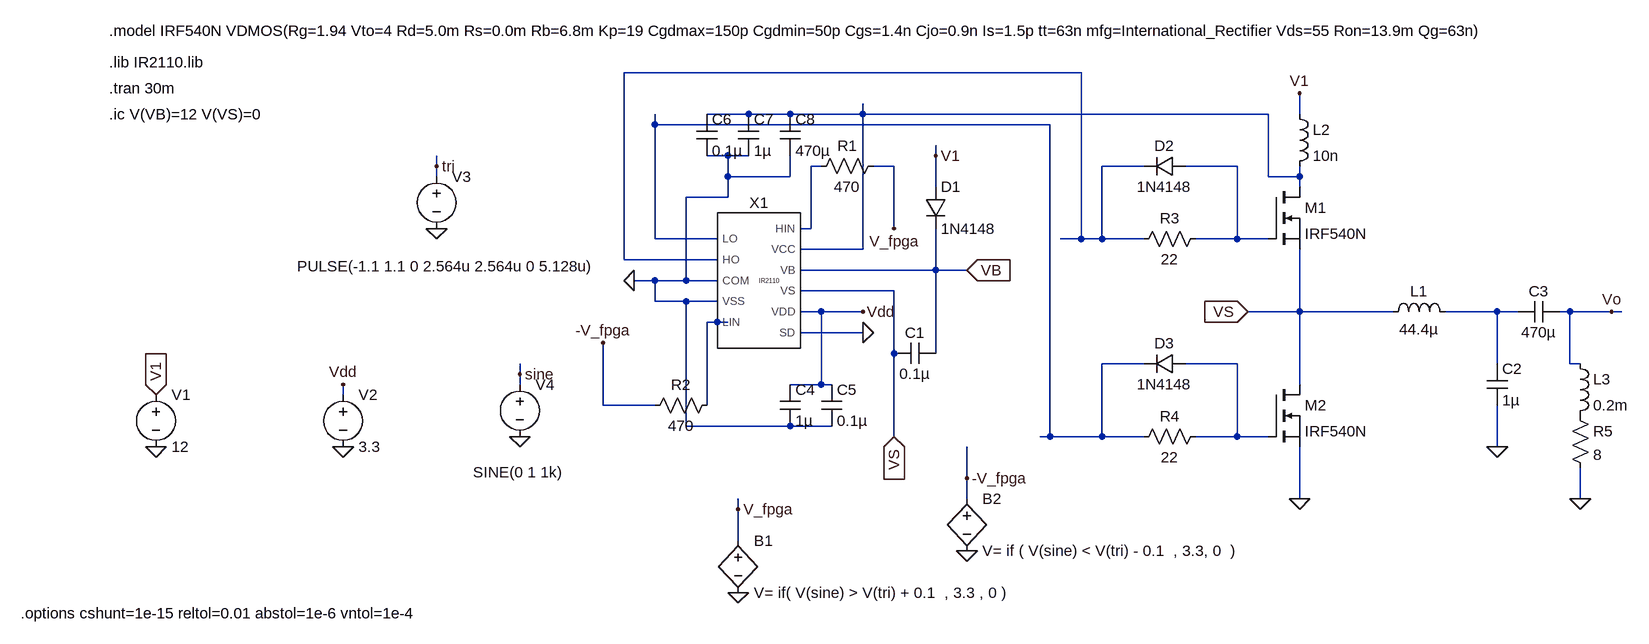
[diagram p0: schematic class_d.asc]
class_d.asc, the LTspice schematic file:
Version 4.1
SHEET 1 1596 704
WIRE 736 -144 32 -144
WIRE 224 -80 160 -80
WIRE 288 -80 224 -80
WIRE 400 -80 400 -96
WIRE 400 -80 288 -80
WIRE 1024 -80 400 -80
WIRE 1072 -80 1072 -112
WIRE 80 -64 80 -80
WIRE 688 -64 80 -64
WIRE 192 -16 160 -16
WIRE 224 -16 192 -16
WIRE 512 -16 512 -32
WIRE -256 0 -256 -16
WIRE 336 0 320 0
WIRE 448 0 416 0
WIRE 832 0 768 0
WIRE 976 0 896 0
WIRE -256 16 -256 0
WIRE 192 16 192 -16
WIRE 288 16 288 -16
WIRE 288 16 192 16
WIRE 1024 16 1024 -80
WIRE 1072 16 1072 0
WIRE 1072 16 1024 16
WIRE 512 32 512 -16
WIRE 1072 32 1072 16
WIRE 192 48 192 16
WIRE 192 48 128 48
WIRE 320 96 320 0
WIRE 320 96 304 96
WIRE 448 96 448 0
WIRE 80 112 80 -64
WIRE 176 112 80 112
WIRE 736 112 736 -144
WIRE 736 112 704 112
WIRE 768 112 768 0
WIRE 768 112 736 112
WIRE 832 112 768 112
WIRE 976 112 976 0
WIRE 976 112 912 112
WIRE 1024 112 976 112
WIRE 400 128 400 -80
WIRE 400 128 304 128
WIRE 32 144 32 -144
WIRE 176 144 32 144
WIRE 512 160 512 96
WIRE 512 160 304 160
WIRE 560 160 512 160
WIRE 80 176 48 176
WIRE 128 176 128 48
WIRE 128 176 80 176
WIRE 176 176 128 176
WIRE 448 192 304 192
WIRE 80 208 80 176
WIRE 128 208 80 208
WIRE 176 208 128 208
WIRE 336 224 304 224
WIRE 400 224 336 224
WIRE 1072 224 1072 128
WIRE 1072 224 992 224
WIRE 1216 224 1072 224
WIRE 1376 224 1296 224
WIRE 1408 224 1376 224
WIRE 1488 224 1472 224
WIRE 1552 224 1488 224
WIRE 1568 224 1552 224
WIRE 176 240 160 240
WIRE 192 240 176 240
WIRE 400 256 304 256
WIRE 448 288 448 192
WIRE 512 288 512 160
WIRE 832 304 768 304
WIRE 976 304 896 304
WIRE 1376 304 1376 224
WIRE 1488 304 1488 224
WIRE 1504 304 1488 304
WIRE -128 320 -128 304
WIRE -128 336 -128 320
WIRE 336 336 336 224
WIRE 336 336 288 336
WIRE 352 336 336 336
WIRE 1072 336 1072 224
WIRE -400 352 -400 336
WIRE 0 368 0 272
WIRE 80 368 0 368
WIRE 160 368 160 240
WIRE 128 400 128 208
WIRE 288 400 128 400
WIRE 352 400 288 400
WIRE 448 416 448 288
WIRE 688 416 688 -64
WIRE 688 416 672 416
WIRE 768 416 768 304
WIRE 768 416 688 416
WIRE 832 416 768 416
WIRE 976 416 976 304
WIRE 976 416 912 416
WIRE 1024 416 976 416
WIRE 1376 432 1376 368
WIRE 560 480 560 432
WIRE 560 512 560 480
WIRE 1072 512 1072 432
WIRE 1504 512 1504 464
WIRE 208 528 208 512
WIRE 208 576 208 528
FLAG -688 432 0
FLAG -400 432 0
FLAG -256 96 0
FLAG -128 416 0
FLAG -688 352 V1
IOPIN -688 352 In
FLAG 448 96 V_fpga
FLAG 48 176 0
FLAG -400 336 Vdd
FLAG 400 224 Vdd
FLAG 400 256 0
FLAG 512 -16 V1
FLAG 560 160 VB
IOPIN 560 160 In
FLAG 448 416 VS
IOPIN 448 416 In
FLAG 1072 512 0
FLAG 992 224 VS
IOPIN 992 224 In
FLAG 1072 -112 V1
FLAG 1376 432 0
FLAG 1504 512 0
FLAG 1552 224 Vo
FLAG 208 656 0
FLAG 208 528 V_fpga
FLAG -128 320 sine
FLAG -256 0 tri
FLAG 560 592 0
FLAG 560 480 -V_fpga
FLAG 0 272 -V_fpga
SYMBOL voltage -688 336 R0
WINDOW 123 0 0 Left 0
WINDOW 39 0 0 Left 0
SYMATTR InstName V1
SYMATTR Value 12
SYMBOL voltage -400 336 R0
WINDOW 123 0 0 Left 0
WINDOW 39 0 0 Left 0
SYMATTR InstName V2
SYMATTR Value 3.3
SYMBOL voltage -256 0 R0
WINDOW 3 -215 154 Left 2
WINDOW 123 0 0 Left 0
WINDOW 39 0 0 Left 0
SYMATTR Value PULSE(-1.1 1.1 0 2.564u 2.564u 0 5.128u)
SYMATTR InstName V3
SYMBOL voltage -128 320 R0
WINDOW 3 -72 151 Left 2
WINDOW 123 0 0 Left 0
WINDOW 39 0 0 Left 0
SYMATTR Value SINE(0 1 1k)
SYMATTR InstName V4
SYMBOL diode 496 32 R0
SYMATTR InstName D1
SYMATTR Value 1N4148
SYMBOL cap 512 272 R90
WINDOW 0 0 32 VBottom 2
WINDOW 3 32 32 VTop 2
SYMATTR InstName C1
SYMATTR Value 0.1µ
SYMBOL nmos 1024 32 R0
SYMATTR InstName M1
SYMATTR Value IRF540N
SYMBOL nmos 1024 336 R0
SYMATTR InstName M2
SYMATTR Value IRF540N
SYMBOL res 928 96 R90
WINDOW 0 0 56 VBottom 2
WINDOW 3 32 56 VTop 2
SYMATTR InstName R3
SYMATTR Value 22
SYMBOL res 928 400 R90
WINDOW 0 0 56 VBottom 2
WINDOW 3 32 56 VTop 2
SYMATTR InstName R4
SYMATTR Value 22
SYMBOL diode 896 -16 R90
WINDOW 0 0 32 VBottom 2
WINDOW 3 32 32 VTop 2
SYMATTR InstName D2
SYMATTR Value 1N4148
SYMBOL diode 896 288 R90
WINDOW 0 0 32 VBottom 2
WINDOW 3 32 32 VTop 2
SYMATTR InstName D3
SYMATTR Value 1N4148
SYMBOL ind 1200 240 R270
WINDOW 0 32 56 VTop 2
WINDOW 3 5 56 VBottom 2
SYMATTR InstName L1
SYMATTR Value 44.4µ
SYMATTR SpiceLine Rser=0.1
SYMBOL cap 1360 304 R0
SYMATTR InstName C2
SYMATTR Value 1µ
SYMBOL res 1488 368 R0
SYMATTR InstName R5
SYMATTR Value 8
SYMBOL bv 208 560 R0
SYMATTR InstName B1
SYMATTR Value V= if( V(sine) > V(tri) + 0.1  , 3.3 , 0 )
SYMBOL bv 560 496 R0
SYMATTR InstName B2
SYMATTR Value V= if ( V(sine) < V(tri) - 0.1  , 3.3, 0  )
SYMBOL IR2110 240 176 R0
WINDOW 3 0 0 Left 0
SYMATTR InstName X1
SYMBOL res 432 -16 R90
WINDOW 0 0 56 VBottom 2
WINDOW 3 32 56 VTop 2
SYMATTR InstName R1
SYMATTR Value 470
SYMBOL res 176 352 R90
WINDOW 0 0 56 VBottom 2
WINDOW 3 32 56 VTop 2
SYMATTR InstName R2
SYMATTR Value 470
SYMBOL cap 1472 208 R90
WINDOW 0 0 32 VBottom 2
WINDOW 3 32 32 VTop 2
SYMATTR InstName C3
SYMATTR Value 470µ
SYMATTR SpiceLine V=16
SYMBOL ind 1056 -96 R0
SYMATTR InstName L2
SYMATTR Value 10n
SYMBOL cap 272 336 R0
SYMATTR InstName C4
SYMATTR Value 1µ
SYMBOL cap 336 336 R0
SYMATTR InstName C5
SYMATTR Value 0.1µ
SYMBOL cap 144 -80 R0
SYMATTR InstName C6
SYMATTR Value 0.1µ
SYMBOL cap 208 -80 R0
SYMATTR InstName C7
SYMATTR Value 1µ
SYMBOL ind 1488 288 R0
SYMATTR InstName L3
SYMATTR Value 0.2m
SYMBOL cap 272 -80 R0
SYMATTR InstName C8
SYMATTR Value 470µ
TEXT -760 -160 Left 2 !.lib IR2110.lib
TEXT -760 -120 Left 2 !.tran 30m
TEXT -760 -208 Left 2 !.model IRF540N VDMOS(Rg=1.94 Vto=4 Rd=5.0m Rs=0.0m Rb=6.8m Kp=19 Cgdmax=150p Cgdmin=50p Cgs=1.4n Cjo=0.9n Is=1.5p tt=63n mfg=International_Rectifier Vds=55 Ron=13.9m Qg=63n)
TEXT -760 -80 Left 2 !.ic V(VB)=12 V(VS)=0
TEXT -896 688 Left 2 !.options cshunt=1e-15 reltol=0.01 abstol=1e-6 vntol=1e-4

The netlist it stands for:
* class_d.asc
V1 V1 0 12
V2 Vdd 0 3.3
V3 tri 0 PULSE(-1.1 1.1 0 2.564u 2.564u 0 5.128u)
V4 sine 0 SINE(0 1 1k)
D1 V1 VB 1N4148
C1 VB VS 0.1µ
M1 N002 N005 VS VS IRF540N
M2 VS N008 0 0 IRF540N
R3 N005 N001 22
R4 N008 N003 22
D2 N005 N001 1N4148
D3 N008 N003 1N4148
L1 VS N006 44.4µ Rser=0.1
C2 N006 0 1µ
R5 P001 0 8
B1 V_fpga 0 V= if( V(sine) > V(tri) + 0.1  , 3.3 , 0 )
B2 -V_fpga 0 V= if ( V(sine) < V(tri) - 0.1  , 3.3, 0  )
X§X1 N003 N001 0 0 N007 N004 N002 VB VS Vdd 0 IR2110  ; pins LO HO COM VSS LIN HIN VCC VB VS VDD SD
R1 V_fpga N004 470
R2 N007 -V_fpga 470
C3 Vo N006 470µ V=16
L2 V1 N002 10n
C4 Vdd 0 1µ
C5 Vdd 0 0.1µ
C6 N002 0 0.1µ
C7 N002 0 1µ
L3 Vo P001 0.2m
C8 N002 0 470µ
.model D D
.lib standard.dio
.model NMOS NMOS
.model PMOS PMOS
.lib standard.mos
.lib IR2110.lib
.tran 30m
.model IRF540N VDMOS(Rg=1.94 Vto=4 Rd=5.0m Rs=0.0m Rb=6.8m Kp=19 Cgdmax=150p Cgdmin=50p Cgs=1.4n Cjo=0.9n Is=1.5p tt=63n mfg=International_Rectifier Vds=55 Ron=13.9m Qg=63n)
.ic V(VB)=12 V(VS)=0
.options cshunt=1e-15 reltol=0.01 abstol=1e-6 vntol=1e-4
.lib IR2110.lib
.backanno
.end